# EAGLE schematic DeMuxRow2 (EAGLE 6.6.0)

## Sheet 1 of 2
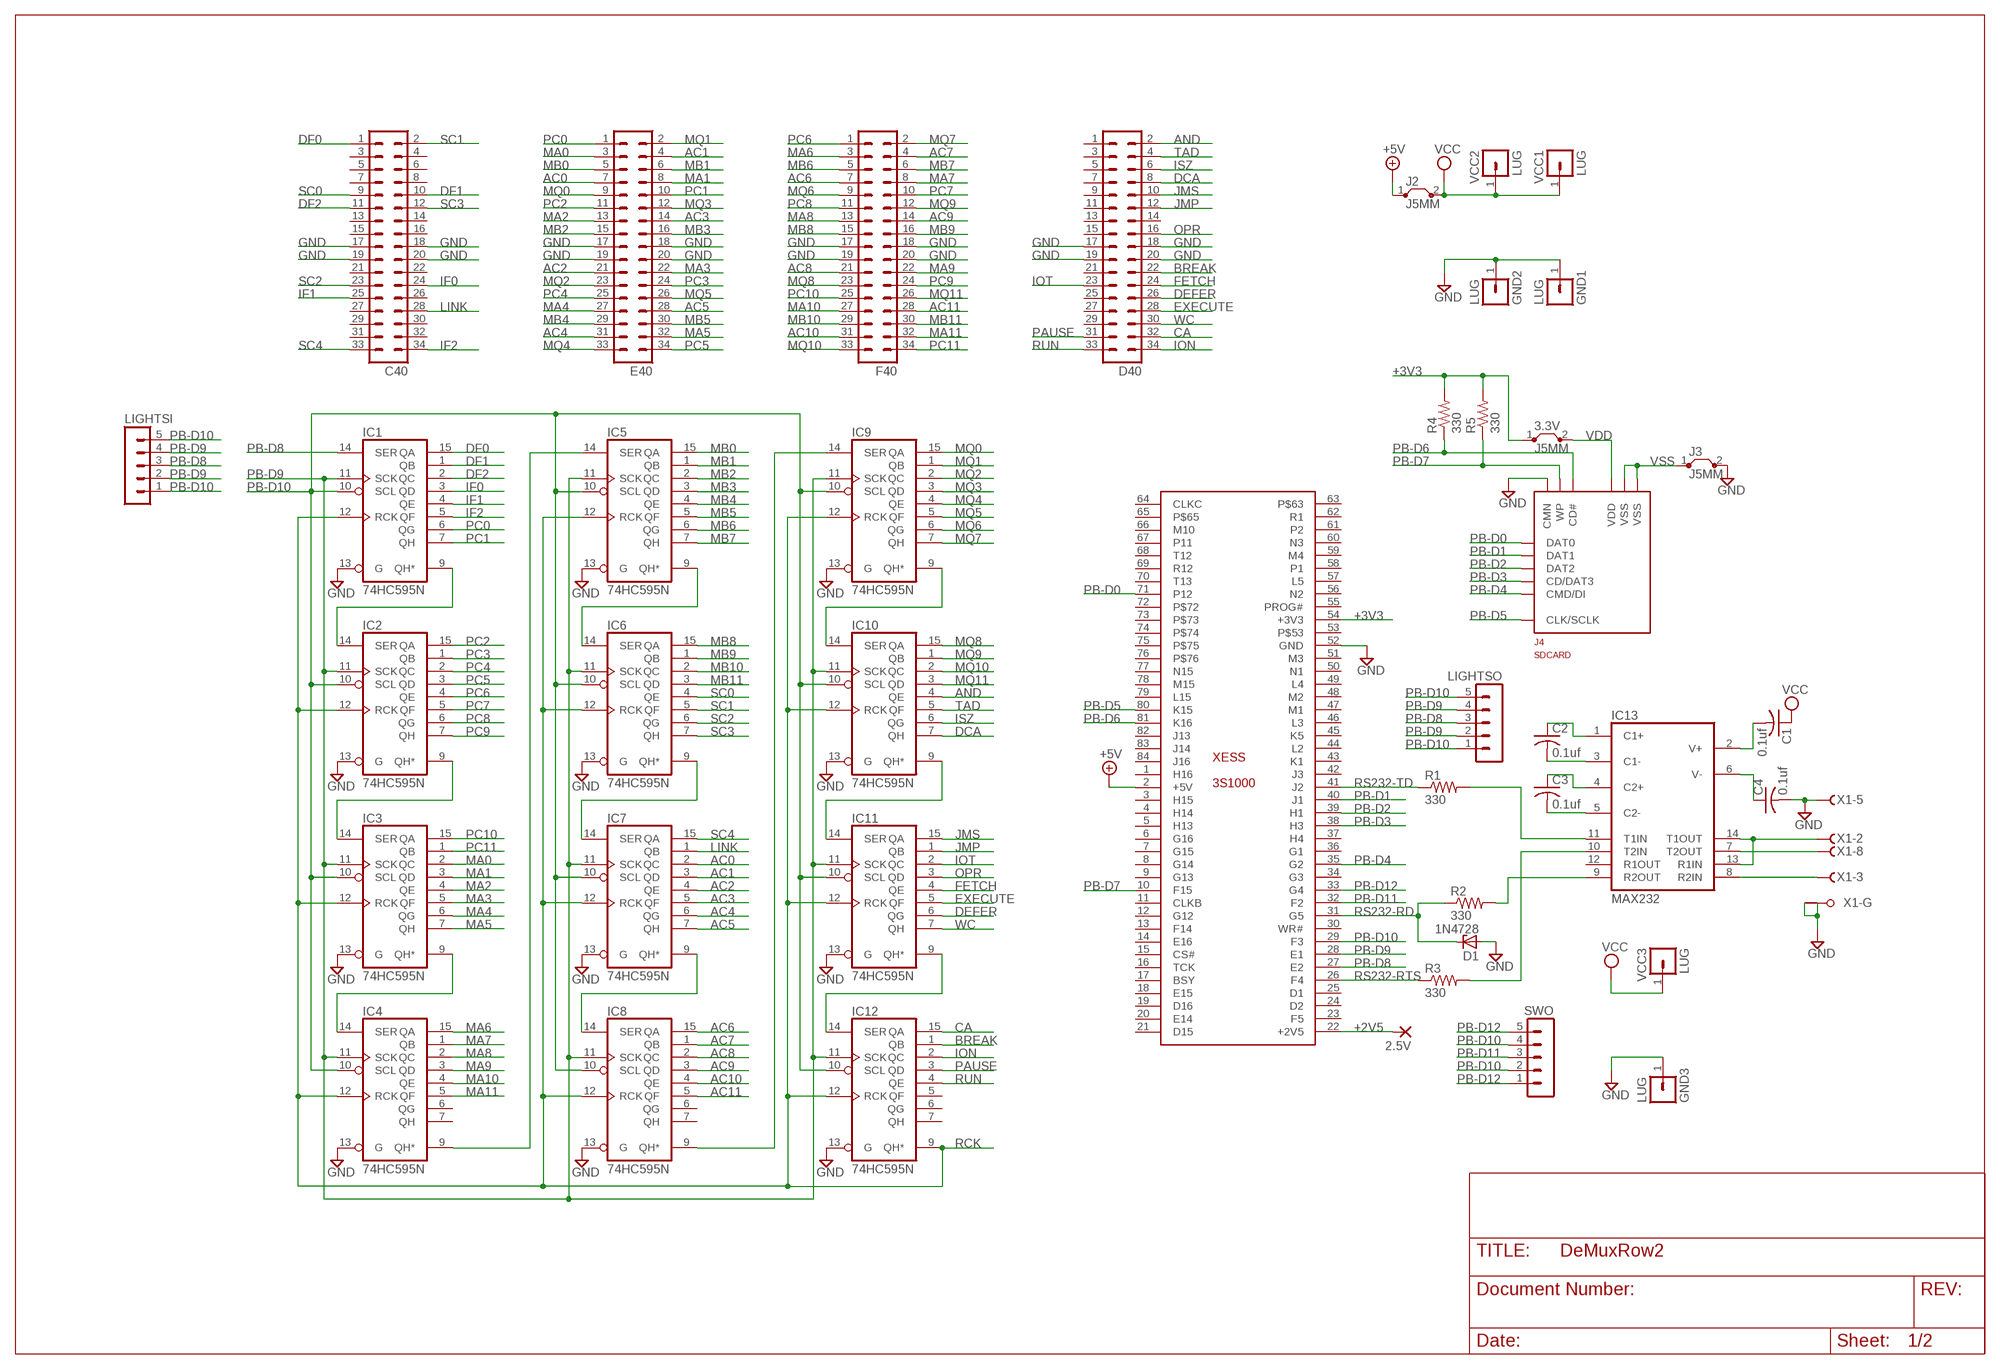
[diagram p0: schematic, sheet 1]

### Parts
2.5V  1,6/0,8  [1,6/0,8]
3.3V  J5MM  [05]
C1  0.1uf  C-US050-025X075  [C050-025X075]
C2  0.1uf  C-US050-025X075  [C050-025X075]
C3  0.1uf  C-US050-025X075  [C050-025X075]
C4  0.1uf  C-US050-025X075  [C050-025X075]
C40  MA17-2  [MA17-2]
D1  1N4728  [DO41Z10]
D40  MA17-2  [MA17-2]
E40  MA17-2  [MA17-2]
F40  MA17-2  [MA17-2]
GND1  LUG  [SPADELUG]
GND2  LUG  [SPADELUG]
GND3  LUG  [SPADELUG]
IC1  74HC595N  74LS595N  [DIL16]
IC2  74HC595N  74LS595N  [DIL16]
IC3  74HC595N  74LS595N  [DIL16]
IC4  74HC595N  74LS595N  [DIL16]
IC5  74HC595N  74LS595N  [DIL16]
IC6  74HC595N  74LS595N  [DIL16]
IC7  74HC595N  74LS595N  [DIL16]
IC8  74HC595N  74LS595N  [DIL16]
IC9  74HC595N  74LS595N  [DIL16]
IC10  74HC595N  74LS595N  [DIL16]
IC11  74HC595N  74LS595N  [DIL16]
IC12  74HC595N  74LS595N  [DIL16]
IC13  MAX232  [DIL16]
J2  J5MM  [05]
J3  J5MM  [05]
J4  SDCARD  [SCDA5A]
LIGHTSI  MA05-1  [MA05-1]
LIGHTSO  MA05-1  [MA05-1]
R1  330  R-US_0207/10  [0207/10]
R2  330  R-US_0207/10  [0207/10]
R3  330  R-US_0207/10  [0207/10]
R4  330  R-US_0207/10  [0207/10]
R5  330  R-US_0207/10  [0207/10]
SWO  MA05-1  [MA05-1]
VCC1  LUG  [SPADELUG]
VCC2  LUG  [SPADELUG]
VCC3  LUG  [SPADELUG]
X1  F09HPS  [F09HP]
XESS  3S1000  [3S1000]

### Nets
+2V5 [supply]: 2.5V.1(P) XESS.22(+2V5)
+3V3 [supply]: 3.3V.1 R4.2 R5.2 XESS.54(+3V3)
+5V [supply]: J2.1 XESS.2(+5V)
AC0: E40.7 IC7.2(QC)
AC1: E40.4 IC7.3(QD)
AC2: E40.21 IC7.4(QE)
AC3: E40.14 IC7.5(QF)
AC4: E40.31 IC7.6(QG)
AC5: E40.28 IC7.7(QH)
AC6: F40.7 IC8.15(QA)
AC7: F40.4 IC8.1(QB)
AC8: F40.21 IC8.2(QC)
AC9: F40.14 IC8.3(QD)
AC10: F40.31 IC8.4(QE)
AC11: F40.28 IC8.5(QF)
AND: D40.2 IC10.4(QE)
BREAK: D40.22 IC12.1(QB)
CA: D40.32 IC12.15(QA)
DCA: D40.8 IC10.7(QH)
DEFER: D40.26 IC11.6(QG)
DF0: C40.1 IC1.15(QA)
DF1: C40.10 IC1.1(QB)
DF2: C40.11 IC1.2(QC)
EXECUTE: D40.28 IC11.5(QF)
FETCH: D40.24 IC11.4(QE)
GND [supply]: C4.2 C40.17 C40.18 C40.19 C40.20 D1.A D40.17 D40.18 D40.19 D40.20 E40.17 E40.18 E40.19 E40.20 F40.17 F40.18 F40.19 F40.20 GND1.1 GND2.1 GND3.1 IC1.13(G) IC2.13(G) IC3.13(G) IC4.13(G) IC5.13(G) IC6.13(G) IC7.13(G) IC8.13(G) IC9.13(G) IC10.13(G) IC11.13(G) IC12.13(G) J3.2 J4.11(CMN) X1.5(-5:F) X1.G1(-G:G1) X1.G2(-G:G2) XESS.52(GND) ; also sheet 2
IF0: C40.24 IC1.3(QD)
IF1: C40.25 IC1.4(QE)
IF2: C40.34 IC1.5(QF)
ION: D40.34 IC12.2(QC)
IOT: D40.23 IC11.2(QC)
ISZ: D40.6 IC10.6(QG)
JMP: D40.12 IC11.1(QB)
JMS: D40.10 IC11.15(QA)
LINK: C40.28 IC7.1(QB)
MA0: E40.3 IC3.2(QC)
MA1: E40.8 IC3.3(QD)
MA2: E40.13 IC3.4(QE)
MA3: E40.22 IC3.5(QF)
MA4: E40.27 IC3.6(QG)
MA5: E40.32 IC3.7(QH)
MA6: F40.3 IC4.15(QA)
MA7: F40.8 IC4.1(QB)
MA8: F40.13 IC4.2(QC)
MA9: F40.22 IC4.3(QD)
MA10: F40.27 IC4.4(QE)
MA11: F40.32 IC4.5(QF)
MB0: E40.5 IC5.15(QA)
MB1: E40.6 IC5.1(QB)
MB2: E40.15 IC5.2(QC)
MB3: E40.16 IC5.3(QD)
MB4: E40.29 IC5.4(QE)
MB5: E40.30 IC5.5(QF)
MB6: F40.5 IC5.6(QG)
MB7: F40.6 IC5.7(QH)
MB8: F40.15 IC6.15(QA)
MB9: F40.16 IC6.1(QB)
MB10: F40.29 IC6.2(QC)
MB11: F40.30 IC6.3(QD)
MQ0: E40.9 IC9.15(QA)
MQ1: E40.2 IC9.1(QB)
MQ2: E40.23 IC9.2(QC)
MQ3: E40.12 IC9.3(QD)
MQ4: E40.33 IC9.4(QE)
MQ5: E40.26 IC9.5(QF)
MQ6: F40.9 IC9.6(QG)
MQ7: F40.2 IC9.7(QH)
MQ8: F40.23 IC10.15(QA)
MQ9: F40.12 IC10.1(QB)
MQ10: F40.33 IC10.2(QC)
MQ11: F40.26 IC10.3(QD)
N$4: IC5.9(QH*) IC6.14(SER)
N$5: IC13.10(T2IN) R3.2
N$6: IC13.11(T1IN) R1.2
N$7: IC13.9(R2OUT) R2.2
N$8: C1.2 IC13.2(V+)
N$9: C2.2 IC13.3(C1-)
N$10: IC1.9(QH*) IC2.14(SER)
N$11: IC2.9(QH*) IC3.14(SER)
N$12: IC3.9(QH*) IC4.14(SER)
N$13: IC7.9(QH*) IC8.14(SER)
N$14: IC6.9(QH*) IC7.14(SER)
N$15: IC11.9(QH*) IC12.14(SER)
N$16: IC10.9(QH*) IC11.14(SER)
N$17: C2.1 IC13.1(C1+)
N$18: C3.1 IC13.4(C2+)
N$19: IC9.9(QH*) IC10.14(SER)
N$20: C3.2 IC13.5(C2-)
N$21: IC4.9(QH*) IC5.14(SER)
N$22: IC8.9(QH*) IC9.14(SER)
N$23: C4.1 IC13.6(V-)
N$24: IC13.13(R1IN) IC13.14(T1OUT) X1.2(-2:F)
N$25: IC13.7(T2OUT) X1.8(-8:F)
N$26: IC13.8(R2IN) X1.3(-3:F)
OPR: D40.16 IC11.3(QD)
PAUSE: D40.31 IC12.3(QD)
PB-D0: J4.7(DAT0) XESS.71(P12)
PB-D1: J4.8(DAT1) XESS.40(J1)
PB-D2: J4.9(DAT2) XESS.39(H1)
PB-D3: J4.1(CD/DAT3) XESS.38(H3)
PB-D4: J4.2(CMD/DI) XESS.35(G2)
PB-D5: J4.5(CLK/SCLK) XESS.80(K15)
PB-D6: J4.10(CD#) R4.1 XESS.81(K16)
PB-D7: J4.12(WP) R5.1 XESS.10(F15)
PB-D8: IC1.14(SER) LIGHTSI.3 LIGHTSO.3 XESS.27(E2)
PB-D9: IC1.11(SCK) IC2.11(SCK) IC3.11(SCK) IC4.11(SCK) IC5.11(SCK) IC6.11(SCK) IC7.11(SCK) IC8.11(SCK) IC9.11(SCK) IC10.11(SCK) IC11.11(SCK) IC12.11(SCK) LIGHTSI.2 LIGHTSI.4 LIGHTSO.2 LIGHTSO.4 XESS.28(E1)
PB-D10: IC1.10(SCL) IC2.10(SCL) IC3.10(SCL) IC4.10(SCL) IC5.10(SCL) IC6.10(SCL) IC7.10(SCL) IC8.10(SCL) IC9.10(SCL) IC10.10(SCL) IC11.10(SCL) IC12.10(SCL) LIGHTSI.1 LIGHTSI.5 LIGHTSO.1 LIGHTSO.5 SWO.2 SWO.4 XESS.29(F3) ; also sheet 2
PB-D11: SWO.3 XESS.32(F2) ; also sheet 2
PB-D12: SWO.1 SWO.5 XESS.33(G4) ; also sheet 2
PC0: E40.1 IC1.6(QG)
PC1: E40.10 IC1.7(QH)
PC2: E40.11 IC2.15(QA)
PC3: E40.24 IC2.1(QB)
PC4: E40.25 IC2.2(QC)
PC5: E40.34 IC2.3(QD)
PC6: F40.1 IC2.4(QE)
PC7: F40.10 IC2.5(QF)
PC8: F40.11 IC2.6(QG)
PC9: F40.24 IC2.7(QH)
PC10: F40.25 IC3.15(QA)
PC11: F40.34 IC3.1(QB)
RCK: IC1.12(RCK) IC2.12(RCK) IC3.12(RCK) IC4.12(RCK) IC5.12(RCK) IC6.12(RCK) IC7.12(RCK) IC8.12(RCK) IC9.12(RCK) IC10.12(RCK) IC11.12(RCK) IC12.9(QH*) IC12.12(RCK)
RS232-RD: D1.C R2.1 XESS.31(G5)
RS232-RTS: R3.1 XESS.26(F4)
RS232-TD: R1.1 XESS.41(J2)
RUN: D40.33 IC12.4(QE)
SC0: C40.9 IC6.4(QE)
SC1: C40.2 IC6.5(QF)
SC2: C40.23 IC6.6(QG)
SC3: C40.12 IC6.7(QH)
SC4: C40.33 IC7.15(QA)
TAD: D40.4 IC10.5(QF)
VCC [supply]: C1.1 J2.2 VCC1.1 VCC2.1 VCC3.1 ; also sheet 2
VDD [supply]: 3.3V.2 J4.4(VDD)
VSS [supply]: J3.1 J4.3(VSS) J4.6(VSS)
WC: D40.30 IC11.7(QH)
Unconnected: C40.3 C40.4 C40.5 C40.6 C40.7 C40.8 C40.13 C40.14 C40.15 C40.16 C40.21 C40.22 C40.26 C40.27 C40.29 C40.30 C40.31 C40.32 D40.1 D40.3 D40.5 D40.7 D40.9 D40.11 D40.13 D40.14 D40.15 D40.21 D40.25 D40.27 D40.29 IC4.6(QG) IC4.7(QH) IC8.6(QG) IC8.7(QH) IC12.5(QF) IC12.6(QG) IC12.7(QH) IC13.12(R1OUT) X1.1(-1:F) X1.4(-4:F) X1.6(-6:F) X1.7(-7:F) X1.9(-9:F) XESS.1(H16) XESS.3(H15) XESS.4(H14) XESS.5(H13) XESS.6(G16) XESS.7(G15) XESS.8(G14) XESS.9(G13) XESS.11(CLKB) XESS.12(G12) XESS.13(F14) XESS.14(E16) XESS.15(CS#) XESS.16(TCK) XESS.17(BSY) XESS.18(E15) XESS.19(D16) XESS.20(E14) XESS.21(D15) XESS.23(F5) XESS.24(D2) XESS.25(D1) XESS.30(WR#) XESS.34(G3) XESS.36(G1) XESS.37(H4) XESS.42(J3) XESS.43(K1) XESS.44(L2) XESS.45(K5) XESS.46(L3) XESS.47(M1) XESS.48(M2) XESS.49(L4) XESS.50(N1) XESS.51(M3) XESS.53 XESS.55(PROG#) XESS.56(N2) XESS.57(L5) XESS.58(P1) XESS.59(M4) XESS.60(N3) XESS.61(P2) XESS.62(R1) XESS.63 XESS.64(CLKC) XESS.65 XESS.66(M10) XESS.67(P11) XESS.68(T12) XESS.69(R12) XESS.70(T13) XESS.72 XESS.73 XESS.74 XESS.75 XESS.76 XESS.77(N15) XESS.78(M15) XESS.79(L15) XESS.82(J13) XESS.83(J14) XESS.84(J16)

## Sheet 2 of 2
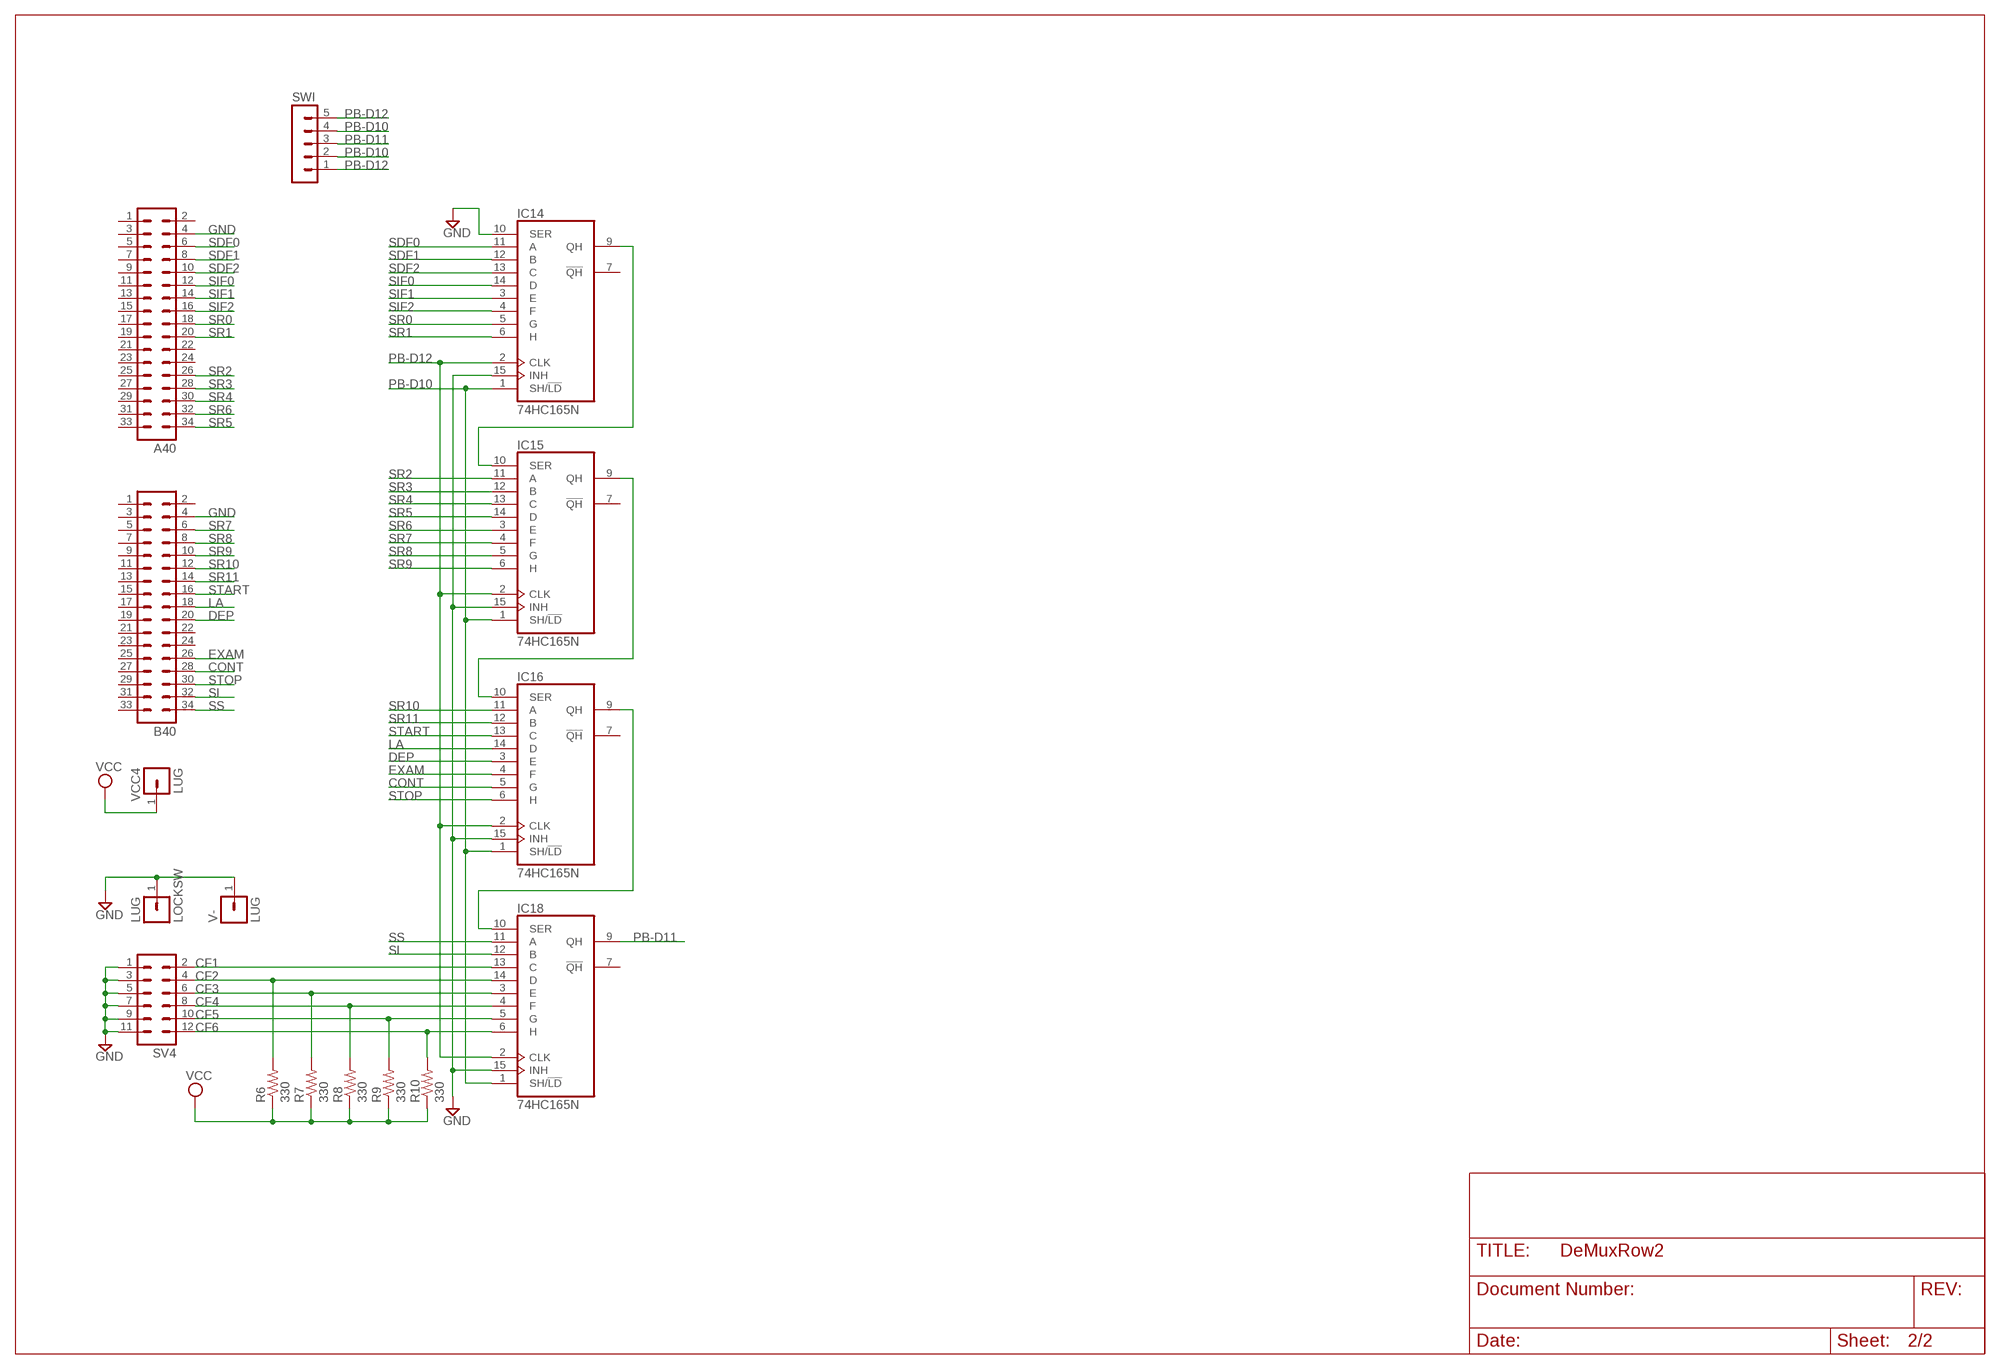
[diagram p1: schematic, sheet 2]

### Parts
A40  MA17-2  [MA17-2]
B40  MA17-2  [MA17-2]
IC14  74HC165N  74LS165N  [DIL16]
IC15  74HC165N  74LS165N  [DIL16]
IC16  74HC165N  74LS165N  [DIL16]
IC18  74HC165N  74LS165N  [DIL16]
LOCKSW  LUG  [SPADELUG]
R6  330  R-US_0207/10  [0207/10]
R7  330  R-US_0207/10  [0207/10]
R8  330  R-US_0207/10  [0207/10]
R9  330  R-US_0207/10  [0207/10]
R10  330  R-US_0207/10  [0207/10]
SV4  MA06-2  [MA06-2]
SWI  MA05-1  [MA05-1]
V-  LUG  [SPADELUG]
VCC4  LUG  [SPADELUG]

### Nets
CF1: IC18.13(C) SV4.2
CF2: IC18.14(D) R6.2 SV4.4
CF3: IC18.3(E) R7.2 SV4.6
CF4: IC18.4(F) R8.2 SV4.8
CF5: IC18.5(G) R9.2 SV4.10
CF6: IC18.6(H) R10.2 SV4.12
CONT: B40.28 IC16.5(G)
DEP: B40.20 IC16.3(E)
EXAM: B40.26 IC16.4(F)
GND [supply]: A40.4 B40.4 IC14.10(SER) IC14.15(INH) IC15.15(INH) IC16.15(INH) IC18.15(INH) LOCKSW.1 SV4.1 SV4.3 SV4.5 SV4.7 SV4.9 SV4.11 V-.1 ; also sheet 1
LA: B40.18 IC16.14(D)
N$1: IC14.9(QH) IC15.10(SER)
N$2: IC15.9(QH) IC16.10(SER)
N$3: IC16.9(QH) IC18.10(SER)
PB-D10: IC14.1(SH/!LD) IC15.1(SH/!LD) IC16.1(SH/!LD) IC18.1(SH/!LD) SWI.2 SWI.4 ; also sheet 1
PB-D11: IC18.9(QH) SWI.3 ; also sheet 1
PB-D12: IC14.2(CLK) IC15.2(CLK) IC16.2(CLK) IC18.2(CLK) SWI.1 SWI.5 ; also sheet 1
SDF0: A40.6 IC14.11(A)
SDF1: A40.8 IC14.12(B)
SDF2: A40.10 IC14.13(C)
SI: B40.32 IC18.12(B)
SIF0: A40.12 IC14.14(D)
SIF1: A40.14 IC14.3(E)
SIF2: A40.16 IC14.4(F)
SR0: A40.18 IC14.5(G)
SR1: A40.20 IC14.6(H)
SR2: A40.26 IC15.11(A)
SR3: A40.28 IC15.12(B)
SR4: A40.30 IC15.13(C)
SR5: A40.34 IC15.14(D)
SR6: A40.32 IC15.3(E)
SR7: B40.6 IC15.4(F)
SR8: B40.8 IC15.5(G)
SR9: B40.10 IC15.6(H)
SR10: B40.12 IC16.11(A)
SR11: B40.14 IC16.12(B)
SS: B40.34 IC18.11(A)
START: B40.16 IC16.13(C)
STOP: B40.30 IC16.6(H)
VCC [supply]: R6.1 R7.1 R8.1 R9.1 R10.1 VCC4.1 ; also sheet 1
Unconnected: A40.1 A40.2 A40.3 A40.5 A40.7 A40.9 A40.11 A40.13 A40.15 A40.17 A40.19 A40.21 A40.22 A40.23 A40.24 A40.25 A40.27 A40.29 A40.31 A40.33 B40.1 B40.2 B40.3 B40.5 B40.7 B40.9 B40.11 B40.13 B40.15 B40.17 B40.19 B40.21 B40.22 B40.23 B40.24 B40.25 B40.27 B40.29 B40.31 B40.33 IC14.7(!QH) IC15.7(!QH) IC16.7(!QH) IC18.7(!QH)

## Power pins joined to a net without a drawn wire
GND: IC1.8(GND) IC2.8(GND) IC3.8(GND) IC4.8(GND) IC5.8(GND) IC6.8(GND) IC7.8(GND) IC8.8(GND) IC9.8(GND) IC10.8(GND) IC11.8(GND) IC12.8(GND) IC13.15(GND) IC14.8(GND) IC15.8(GND) IC16.8(GND) IC18.8(GND) J4.13(GND) J4.14(GND)
VCC: IC1.16(VCC) IC2.16(VCC) IC3.16(VCC) IC4.16(VCC) IC5.16(VCC) IC6.16(VCC) IC7.16(VCC) IC8.16(VCC) IC9.16(VCC) IC10.16(VCC) IC11.16(VCC) IC12.16(VCC) IC13.16(VCC) IC14.16(VCC) IC15.16(VCC) IC16.16(VCC) IC18.16(VCC)

## Library data of the parts
2.5V = wirepad:1,6/0,8: THROUGH-HOLE PAD
3.3V J2 J3 = jumper:J: Bridge
A40 B40 C40 D40 E40 F40 = con-lstb:MA17-2: PIN HEADER; OC_FARNELL: unknown; OC_NEWARK: unknown
C1-C4 = rcl:C-US: CAPACITOR, American symbol
D1 = diode:1N4728: Z DIODE 3.3 V, 1W, 5 percent
GND1-GND3 LOCKSW V- VCC1-VCC4 = dec-con:LUG: Spade Lug
IC1-IC12 = 74xx-us:74*595: 8-bit SHIFT REGISTER, output latch
IC13 = maxim:MAX232: RS232 TRANSCEIVER; MF: MAXIM; MPN: MAX232ACPE+; OC_FARNELL: 9723773; OC_NEWARK: 68K4544
IC14-IC16 IC18 = 74xx-us:74*165: 8-bit parallel load SHIFT REGISTER
J4 = sdcards:SDCARD: SD Card Holder
LIGHTSI LIGHTSO SWI SWO = con-lstb:MA05-1: PIN HEADER; OC_FARNELL: unknown; OC_NEWARK: unknown
R1-R10 = rcl:R-US_: RESISTOR, American symbol
SV4 = con-lstb:MA06-2: PIN HEADER; OC_FARNELL: unknown; OC_NEWARK: unknown
X1 = con-subd:F09HPS: SUB-D; OC_FARNELL: unknown; OC_NEWARK: unknown
XESS = xess:3S1000

## Net classes
1 supply: width 0.762 mm